# Altium schematic sheet MCU.SchDoc
size A4; SheetNumber: 1; SheetTotal: 2
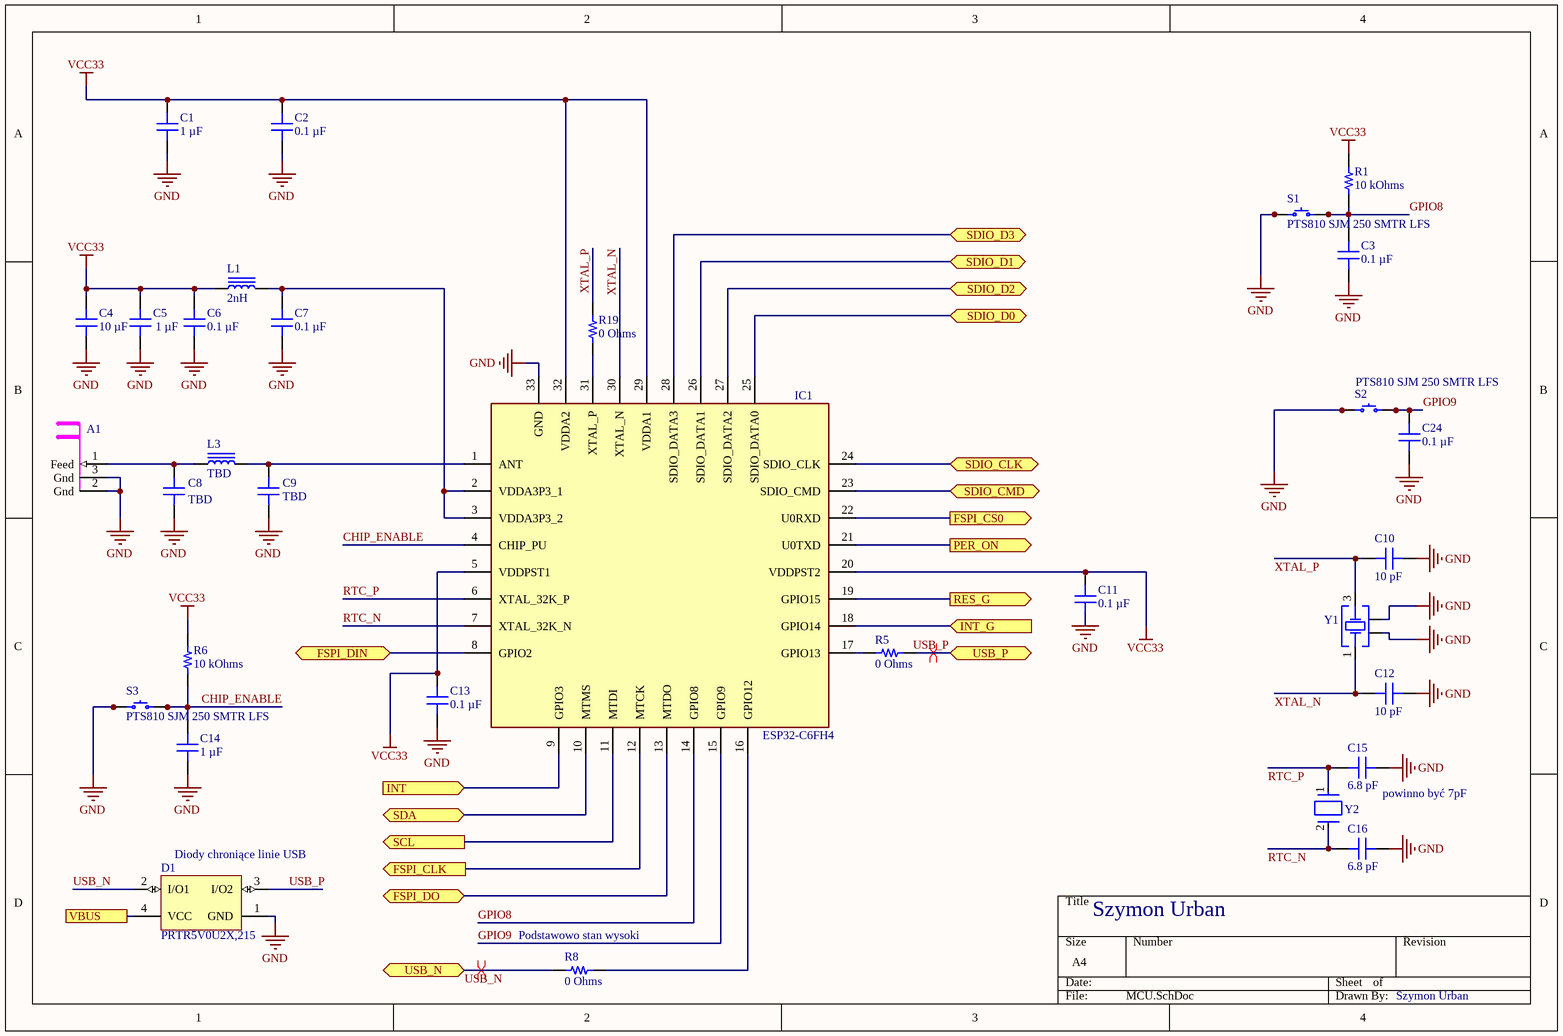
[diagram p0: MCU.SchDoc]

## Parts
A1  Inverted F Antenna 2.4GHz  [IFA_2.4GHz]  (value not drawn)  (net tie, no BOM)
C1  1 µF  [CAP 0603_1608]
C2  0.1 µF  [CAP 0603_1608]
C3  0.1 µF  [CAP 0603_1608]
C4  10 µF  [CAP 0603_1608]
C5  1 µF  [CAP 0603_1608]
C6  0.1 µF  [CAP 0603_1608]
C7  0.1 µF  [CAP 0603_1608]
C8  TBD  [CAP 0402_1005]
C9  TBD  [CAP 0402_1005]
C10  10 pF  [CAP 0603_1608]
C11  0.1 µF  [CAP 0603_1608]
C12  10 pF  [CAP 0603_1608]
C13  0.1 µF  [CAP 0603_1608]
C14  1 µF  [CAP 0603_1608]
C15  6.8 pF  [CAP 0603_1608]
C16  6.8 pF  [CAP 0603_1608]
C24  0.1 µF  [CAP 0603_1608]
D1  PRTR5V0U2X,215  [NXP-SOT143B-4_V]
IC1  ESP32-C6FH4  [QFN50P500X500X90-33N]
L1  2nH  [IND 0603_1608 RF WW]
L3  TBD  [IND 0402_1005 RF WW]
R1  10 kOhms  [RES 0603_1608]
R5  0 Ohms  [RES 0603_1608]
R6  10 kOhms  [RES 0603_1608]
R8  0 Ohms  [RES 0603_1608]
R19  0 Ohms  [RES 0603_1608]
S1  PTS810 SJM 250 SMTR LFS  [C&K PTS810]
S2  PTS810 SJM 250 SMTR LFS  [C&K PTS810]
S3  PTS810 SJM 250 SMTR LFS  [C&K PTS810]
Y1  830108208709  [WE-XTAL_CFPX-218]  (value not drawn)
Y2  ABS07-32.768KHZ-7-1-T  [FP-ABS07-MFG]  (value not drawn)

## Ports
FSPI_CLK (out, see peripherals[2D]), FSPI_CS0 (out, see peripherals[2D]), FSPI_DIN (bidir, see peripherals[2D]), FSPI_DO (bidir, see peripherals[2D]), INT (in, see peripherals[4C]), INT_G (in, see peripherals[2C]), PER_ON (out, see peripherals[1D]), RES_G (out, see peripherals[2C]), SCL (out, see peripherals[2C], peripherals[3D]), SDA (bidir, see peripherals[2C], peripherals[3D]), SDIO_CLK (bidir, see peripherals[4B]), SDIO_CMD (bidir, see peripherals[4B]), SDIO_D0 (bidir, see peripherals[4A]), SDIO_D1 (bidir, see peripherals[4A]), SDIO_D2 (bidir, see peripherals[4A]), SDIO_D3 (bidir, see peripherals[4B]), USB_N (bidir, see peripherals[3A], peripherals[3B]), USB_P (bidir, see peripherals[3A], peripherals[3B]), VBUS (see peripherals[1A], peripherals[3A])

## Nets
GND: A1.2(Gnd) A1.3(Gnd) C1.1 C2.1 C3.1 C4.2 C5.1 C6.1 C7.1 C8.1 C9.1 C10.2 C11.1 C12.2 C13.1 C14.1 C15.2 C16.2 C24.1 D1.1(GND) IC1.33(GND) S1.1 S1.2 S2.1 S2.2 S3.1 S3.2 Y1.2(GND) Y1.4(GND)
VCC33: C1.2 C2.2 C4.1 C5.2 C6.2 C11.2 C13.2 IC1.5(VDDPST1) IC1.20(VDDPST2) IC1.29(VDDA1) IC1.32(VDDA2) L1.1 R1.2 R6.2
CHIP_ENABLE: C14.2 IC1.4(CHIP_PU) R6.1 S3.3 S3.4
FSPI_CLK: IC1.12(MTCK) ; port FSPI_CLK
FSPI_CS0: IC1.22(U0RXD) ; port FSPI_CS0
FSPI_DIN: IC1.8(GPIO2) ; port FSPI_DIN
FSPI_DO: IC1.13(MTDO) ; port FSPI_DO
GPIO8: C3.2 IC1.14(GPIO8) R1.1 S1.3 S1.4
GPIO9: C24.2 IC1.15(GPIO9) S2.3 S2.4
INT: IC1.9(GPIO3) ; port INT
INT_G: IC1.18(GPIO14) ; port INT_G
PER_ON: IC1.21(U0TXD) ; port PER_ON
RES_G: IC1.19(GPIO15) ; port RES_G
RTC_N: C16.1 IC1.7(XTAL_32K_N) Y2.2
RTC_P: C15.1 IC1.6(XTAL_32K_P) Y2.1
SCL: IC1.11(MTDI) ; port SCL
SDA: IC1.10(MTMS) ; port SDA
SDIO_CLK: IC1.24(SDIO_CLK) ; port SDIO_CLK
SDIO_CMD: IC1.23(SDIO_CMD) ; port SDIO_CMD
SDIO_D0: IC1.25(SDIO_DATA0) ; port SDIO_D0
SDIO_D1: IC1.26(SDIO_DATA1) ; port SDIO_D1
SDIO_D2: IC1.27(SDIO_DATA2) ; port SDIO_D2
SDIO_D3: IC1.28(SDIO_DATA3) ; port SDIO_D3
USB_N: D1.2(I/O1) R8.2 ; port USB_N
USB_P: D1.3(I/O2) R5.1 ; port USB_P
VBUS: D1.4(VCC) ; port VBUS
XTAL_N: C12.1 IC1.30(XTAL_N) Y1.1(Crystal)
XTAL_P: C10.1 R19.1 Y1.3(Crystal)
NetA1_1: A1.1(Feed) C8.2 L3.1
NetC7_2: C7.2 IC1.2(VDDA3P3_1) IC1.3(VDDA3P3_2) L1.2
NetC9_2: C9.2 IC1.1(ANT) L3.2
NetIC1_16: IC1.16(GPIO12) R8.1
NetIC1_17: IC1.17(GPIO13) R5.2
NetIC1_31: IC1.31(XTAL_P) R19.2

## Layout directives
differential pair; net class USB_P: USB_N
differential pair: USB_P

## Notes on the sheet
- (near C15) powinno być 7pF
- (near D1) Diody chroniące linie USB
- Szymon Urban
- (near R8) Podstawowo stan wysoki

## Library data of the parts
A1 = IFA_2.4GHz
C1 C5 C14 = CC0603KRX7R6BB105: CAP CER 1UF 10V X7R 0603; manufacturer: Yageo; Tolerance: ±10%; Part Number: CC0603KRX7R6BB105; Value: 1 µF; Applications: General Purpose; Capacitance: 1 µF; componentlink1description: Datasheet; componentlink1url: https://www.yageo.com/upload/media/product/productsearch/datasheet/mlcc/UPY-GPHC_X7R_6.3V-to-50V_18.pdf; componentlink2description: DigiKey Link; componentlink2url: https://www.digikey.com/en/products/detail/yageo/CC0603KRX7R6BB105/5195204; Device Package: 0603 (1608 Metric); lastupdated: 15.01.2024 20:10:05; Lifecycle Status: Active; Minimum Order: 1; Mounting Type: Surface Mount, MLCC; Operating Temperature: -55°C ~ 125°C; Package / Case: 0603 (1608 Metric); packaging: TapeAndReel; partid: 2290; Part Status: Active; price: 0.01; series: CC; Size / Dimension: 0.063" L x 0.031" W (1.60mm x 0.80mm); Supplier 1: DigiKey; Supplier Part Number 1: 311-1796-1-ND; Temperature Coefficient: X7R; Thickness (Max): 0.035" (0.90mm); Voltage - Rated: 10V
C2 C3 C6 C7 C11 C13 C24 = CS0603KRX7R7BB104: CAP CER 0.1UF 16V X7R 0603; manufacturer: Yageo; Tolerance: ±10%; Part Number: CS0603KRX7R7BB104; Value: 0.1 µF; Applications: Boardflex Sensitive; Capacitance: 0.1 µF; componentlink1description: Datasheet; componentlink1url: http://www.yageo.com/NewPortal/yageodocoutput?fileName=/pdf/MLCC/UPY-ST_NPOX7R_16V-to-3KV_5.pdf; componentlink2description: DigiKey Link; componentlink2url: https://www.digikey.com/en/products/detail/yageo/CS0603KRX7R7BB104/6097897; Device Package: 0603 (1608 Metric); Features: Soft Termination; lastupdated: 15.01.2024 20:10:05; Lifecycle Status: Active; Minimum Order: 1; Mounting Type: Surface Mount, MLCC; Operating Temperature: -55°C ~ 125°C; Package / Case: 0603 (1608 Metric); packaging: TapeAndReel; partid: 2286; Part Status: Active; price: 0.01; series: CS; Size / Dimension: 0.063" L x 0.031" W (1.60mm x 0.80mm); Supplier 1: DigiKey; Supplier Part Number 1: 311-3560-1-ND; Temperature Coefficient: X7R; Thickness (Max): 0.037" (0.95mm); Voltage - Rated: 16V
C4 = GRM188D71A106KA73D: CAP CER 10UF 10V X7T 0603; manufacturer: Murata Electronics; Tolerance: ±10%; Part Number: GRM188D71A106KA73D; Value: 10 µF; Applications: General Purpose; Capacitance: 10 µF; componentlink1description: Datasheet; componentlink1url: https://search.murata.co.jp/Ceramy/image/img/A01X/G101/ENG/GRM188D71A106KA73-01.pdf; componentlink2description: DigiKey Link; componentlink2url: https://www.digikey.com/en/products/detail/murata-electronics/GRM188D71A106KA73D/6606090; Device Package: 0603 (1608 Metric); lastupdated: 15.01.2024 20:10:04; Lifecycle Status: Active; Minimum Order: 1; Mounting Type: Surface Mount, MLCC; Operating Temperature: -55°C ~ 125°C; Package / Case: 0603 (1608 Metric); packaging: TapeAndReel; partid: 2489; Part Status: Active; price: 0.03; series: GRM; Size / Dimension: 0.063" L x 0.031" W (1.60mm x 0.80mm); Supplier 1: DigiKey; Supplier Part Number 1: 490-14461-1-ND; Temperature Coefficient: X7T; Thickness (Max): 0.039" (1.00mm); Voltage - Rated: 10V
C8 C9 = 04023A6R8CAT2A: CAP CER 6.8PF 25V C0G/NP0 0402; manufacturer: AVX Corporation; Temperature Coefficient: C0G, NP0; Tolerance: ±0.25pF; Part Number: 04023A6R8CAT2A; Value: TBD; Applications: General Purpose; componentlink1description: Datasheet; componentlink1url: http://datasheets.avx.com/C0GNP0-Dielectric.pdf; componentlink2description: DigiKey Link; componentlink2url: http://digikey.com/product-detail/en/avx-corporation/04023A6R8CAT2A/478-12617-1-ND/9949155; Device Package: 0402 (1005 Metric); lastupdated: 08.02.2022 12:26:50; Lifecycle Status: Active; Minimum Order: 1; Mounting Type: Surface Mount, MLCC; Operating Temperature: -55°C ~ 125°C; Package / Case: 0402 (1005 Metric); packaging: TapeAndReel; partid: 6987; Part Status: Active; price: 0.06; series: -; Size / Dimension: 0.039" L x 0.020" W (1.00mm x 0.50mm); Supplier 1: DigiKey; Supplier Part Number 1: 478-12617-1-ND; Thickness (Max): 0.022" (0.56mm); Voltage - Rated: 25V
  C8: Capacitance: TBD
  C9: Capacitance: 6.8pF
C10 C12 = VJ0603A100FXACW1BC: CAP CER 10PF 50V C0G/NP0 0603; manufacturer: Vishay Vitramon; Temperature Coefficient: C0G, NP0; Tolerance: ±1%; Part Number: VJ0603A100FXACW1BC; Value: 10 pF; Applications: General Purpose; Capacitance: 10 pF; componentlink1description: Datasheet; componentlink1url: https://www.vishay.com/docs/28548/vjw1bcbascomseries.pdf; componentlink2description: DigiKey Link; componentlink2url: https://www.digikey.com/en/products/detail/vishay-vitramon/VJ0603A100FXACW1BC/8302770; Device Package: 0603 (1608 Metric); lastupdated: 15.01.2024 20:09:38; Lifecycle Status: Active; Minimum Order: 1; Mounting Type: Surface Mount, MLCC; Operating Temperature: -55°C ~ 125°C; Package / Case: 0603 (1608 Metric); packaging: TapeAndReel; partid: 42121; Part Status: Active; price: 0.01; series: VJ W1BC; Size / Dimension: 0.063" L x 0.031" W (1.60mm x 0.80mm); Supplier 1: DigiKey; Supplier Part Number 1: 720-VJ0603A100FXACW1BCCT-ND; Thickness (Max): 0.034" (0.87mm); Voltage - Rated: 50V
C15 C16 = GQM1875C2E6R8WB12D: CAP CER 6.8PF 250V C0G/NP0 0603; manufacturer: Murata Electronics; Temperature Coefficient: C0G, NP0; Tolerance: ±0.05pF; Part Number: GQM1875C2E6R8WB12D; Value: 6.8 pF; Applications: RF, Microwave, High Frequency; Capacitance: 6.8 pF; componentlink1description: Datasheet; componentlink1url: https://search.murata.co.jp/Ceramy/image/img/A01X/G101/ENG/GQM1875C2E6R8WB12-01.pdf; componentlink2description: DigiKey Link; componentlink2url: https://www.digikey.com/en/products/detail/murata-electronics/GQM1875C2E6R8WB12D/16033646; Device Package: 0603 (1608 Metric); Features: High Q, Low Loss; lastupdated: 15.01.2024 20:09:09; Lifecycle Status: Active; Minimum Order: 1; Mounting Type: Surface Mount, MLCC; Operating Temperature: -55°C ~ 125°C; Package / Case: 0603 (1608 Metric); packaging: TapeAndReel; partid: 50061; Part Status: Active; price: 0.11; series: GQM; Size / Dimension: 0.063" L x 0.031" W (1.60mm x 0.80mm); Supplier 1: DigiKey; Supplier Part Number 1: 490-GQM1875C2E6R8WB12DCT-ND; Thickness (Max): 0.031" (0.80mm); Voltage - Rated: 250V
D1 = CMP-2000-05285-1: Ultra Low Capacitance Double Rail-to-Rail ESD Protection Diode, 5.5 V, 1 pF, -40 to 85 degC, 4-Pin SOT143B, RoHS, Tape and Reel; Manufacturer: NXP Semiconductors; Capacitance Value: 16pF; Number of Elements: 1; Rad Hardened: No; Reverse Breakdown Voltage: 6V; Working Voltage (Max): 5.5V; Polarity: Uni-Directional; Configuration: Quad; Leakage Current: 0.1uA; Product Height (mm): 1mm; Suppressor Type: DiodeArrays; Product Length (mm): 3mm; Product Depth (mm): 1.4mm; ESD Protection Voltage: 8KV@ContactDisc; Package Type: SOT; Mounting: SurfaceMount; Packaging: TapeandReel; Datasheet Version: Rev. 02, 01/2008; Reverse Stand-off Voltage: 5.5V; Manufacturer URL: http://www.nxp.com/; Operating Temp Range: -40Cto85C; Operating Temperature Classification: Industrial; Working Voltage: 5.5V; Operating Temperature Min Deg. C: -40C; Datasheet URL: https://datasheet.ciiva.com/4479/prtr5v0u2x-102853-4479461.pdf; Leakage Current (Max): 0.1uA; Direction Type: Uni-Directional; Pin Count: 3+Tab; Operating Temperature Max Deg. C: 85C; Mounting Style: SurfaceMount; Package / Case: SOT
IC1 = ESP32-C6FH4: Integrated Circuit; Manufacturer_Name: Espressif Systems; Datasheet Link: https://www.mouser.ch/ProductDetail/Espressif-Systems/ESP32-C6FH4?qs=sGAEpiMZZMu3sxpa5v1qriveB5Rxa06Y9iJOmwW58jU%3D; Height: 0.9mm; Manufacturer_Part_Number: ESP32-C6FH4; Mouser Part Number: 356-ESP32-C6FH4; Mouser Price/Stock: https://www.mouser.co.uk/ProductDetail/Espressif-Systems/ESP32-C6FH4?qs=Imq1NPwxi77uZvg%252BuAIiXA%3D%3D
L1 = 744761020A: FIXED IND 2NH 700MA 80 MOHM SMD; Manufacturer: Würth Elektronik; DC Resistance (DCR): 80mOhm Max; Frequency - Self Resonant: 6.9GHz; Inductance Frequency - Test: 250MHz; Material - Core: Ceramic; Q @ Freq: 16 @ 250MHz; Shielding: Unshielded; Tolerance: ±0.2nH; Type: Wirewound; Part Number: 744761020A; ComponentLink1Description: Datasheet; ComponentLink1URL: https://katalog.we-online.com/pbs/datasheet/744761020A.pdf; ComponentLink2Description: DigiKey Link; ComponentLink2URL: http://digikey.com/product-detail/en/w-rth-elektronik/744761020A/732-744761020ACT-ND/10668665; Current Rating (Amps): 700mA; Device Package: 0603 (1608 Metric); Inductance: 2nH; LastUpdated: 06.09.2020 11:05:18; Lifecycle Status: Active; Minimum Order: 1; Mounting Type: Surface Mount; Operating Temperature: -40°C ~ 125°C; Package / Case: 0603 (1608 Metric); Packaging: Unknown; PartId: 1038; Part Status: Active; Price: 0.18; Series: WE-KI; Supplier 1: DigiKey; Supplier Part Number 1: 732-744761020ACT-ND; Supplier Device Package: 0603; Value: 2nH
L3 = LQW18ASR39J00D: FIXED IND 390NH 100MA 4.35OHM SM; Manufacturer: Murata Electronics; DC Resistance (DCR): 4.35Ohm Max; Frequency - Self Resonant: 900MHz; Inductance Frequency - Test: 100 MHz; Material - Core: Non-Magnetic; Q @ Freq: 25 @ 100MHz; Shielding: Unshielded; Tolerance: ±5%; Type: Wirewound; Part Number: LQW18ASR39J00D; ComponentLink2Description: DigiKey Link; ComponentLink2URL: https://www.digikey.com/en/products/detail/murata-electronics/LQW18ASR39J00D/10702651; Current Rating (Amps): 100 mA; Device Package: 0603 (1608 Metric); Height - Seated (Max): 0.039" (1.00mm); Inductance: 390 nH; LastUpdated: 15.01.2024 21:33:43; Lifecycle Status: Active; Minimum Order: 1; Mounting Type: Surface Mount; Operating Temperature: -40°C ~ 125°C; Package / Case: 0603 (1608 Metric); Packaging: TapeAndReel; PartId: 1604; Part Status: Active; Price: 0.05; Series: LQW15; Size / Dimension: 0.063" L x 0.031" W (1.60mm x 0.80mm); Supplier 1: DigiKey; Supplier Part Number 1: 490-LQW18ASR39J00DCT-ND; Supplier Device Package: 0603; Value: TBD
R1 R6 = RT0603FRE0710KL: RES SMD 10K OHM 1% 1/10W 0603; Manufacturer: Yageo; Power (Watts): 0.1W, 1/10W; Temperature Coefficient: ±50ppm/°C; Part Number: RT0603FRE0710KL; Value: 10 kOhms; ComponentLink1Description: Datasheet; ComponentLink1URL: https://www.yageo.com/upload/media/product/productsearch/datasheet/rchip/PYu-RT_1-to-0.01_RoHS_L_11.pdf; ComponentLink2Description: DigiKey Link; ComponentLink2URL: https://www.digikey.com/en/products/detail/yageo/RT0603FRE0710KL/1075040; Composition: Thin Film; Device Package: 0603 (1608 Metric); Height - Seated (Max): 0.022" (0.55mm); LastUpdated: 15.01.2024 20:40:25; Lifecycle Status: Active; Minimum Order: 1; Number of Terminations: 2; Operating Temperature: -55°C ~ 155°C; Package / Case: 0603 (1608 Metric); Packaging: TapeAndReel; PartId: 5671; Part Status: Active; Price: 0.01; Resistance: 10 kOhms; Series: RT; Size / Dimension: 0.063" L x 0.031" W (1.60mm x 0.80mm); Supplier 1: DigiKey; Supplier Part Number 1: YAG2321CT-ND; Supplier Device Package: 0603; Tolerance: ±1%
R5 R8 R19 = JR0603X26E: 0603 26 AMP JUMPER; Manufacturer: Ohmite; Power (Watts): 0.135W; Part Number: JR0603X26E; Value: 0 Ohms; ComponentLink1Description: Datasheet; ComponentLink1URL: https://www.ohmite.com/assets/docs/res_jr.pdf?r=false; ComponentLink2Description: DigiKey Link; ComponentLink2URL: https://www.digikey.com/en/products/detail/ohmite/JR0603X26E/10233371; Composition: Metal Element; Device Package: 0603 (1608 Metric); Height - Seated (Max): 0.022" (0.55mm); LastUpdated: 15.01.2024 20:40:20; Lifecycle Status: Active; Minimum Order: 1; Number of Terminations: 2; Operating Temperature: -55°C ~ 150°C; Package / Case: 0603 (1608 Metric); Packaging: TapeAndReel; PartId: 6812; Part Status: Active; Price: 0.10; Resistance: 0 Ohms; Series: JR; Size / Dimension: 0.063" L x 0.031" W (1.60mm x 0.80mm); Supplier 1: DigiKey; Supplier Part Number 1: JR0603X26ECT-ND; Supplier Device Package: 0603; Tolerance: Jumper
S1-S3 = PTS810 SJM 250 SMTR LFS: SWITCH TACTILE SPST-NO 0.05A 16V; Manufacturer: C&K; Actuator Height off PCB, Vertical: 2.50mm; Actuator Orientation: Top Actuated; Actuator Type: Oval Button; Contact Rating @ Voltage: 0.05A @ 16VDC; Illumination: Non-Illuminated; Operating Force: 160gf; Outline: 4.20mm x 3.20mm; Switch Function: Off-Mom; Part Number: PTS810 SJM 250 SMTR LFS; Circuit: SPST-NO; ComponentLink1Description: Datasheet; ComponentLink1URL: https://dznh3ojzb2azq.cloudfront.net/products/Tactile/PTS810/documents/datasheet.pdf; ComponentLink2Description: DigiKey Link; ComponentLink2URL: http://digikey.com/product-detail/en/c-k/PTS810-SJM-250-SMTR-LFS/CKN10502CT-ND/4176673; LastUpdated: 09.04.2020 10:00:13; Lifecycle Status: Active; Minimum Order: 1; Mounting Type: Surface Mount; Operating Temperature: -40°C ~ 85°C; Packaging: TapeAndReel; Part Status: Active; Price: 0.16; Series: PTS810; Supplier 1: DigiKey; Supplier Part Number 1: CKN10502CT-ND; Termination Style: J Lead
Y1 = CMP-03913-116855769-1: 830108208709 WE-XTAL Quartz Crystal; Frequency: 40MHz; Width: 2mm; Max Operating Temperature: 70°C; Height: 600µm; Min Operating Temperature: -20°C; NexarPartId: 116855769; Length: 2.5mm
Y2 = CMP-27762-015873-1: Crystal 32.768kHz ±10ppm (Tol) 7pF FUND 70kΩ 2-Pin CSMD T/R; ESR (Equivalent Series Resistance): 70kR; Min Operating Temperature: -40°C; Height: 0.035inch; Max Operating Temperature: 85°C; Length: 0.126inch; RoHS Compliant: Yes; Width: 0.061inch; Frequency Tolerance: 10ppm; Lead Free: Lead Free; Operating Frequency: 32.768 kHz; Packaging: Cut Tape; Series: ABS07; Case/Package: SMD/SMT; Frequency: 32.768kHz; Load Capacitance: 7pF; Mount: Surface Mount